# Altium schematic sheet HPC_EF.SchDoc: HPC connector ROW E and ROW F
size A4; Date: 20.05.2022; ApprovedBy: PFH; CompanyName: IAM Electronic GmbH; DrawnBy: PFH; Engineer: PFH; Revision: A; SheetNumber: 4; SheetTotal: 6; Projekt: FMC Power Module; Website: www.iamelectronic.com
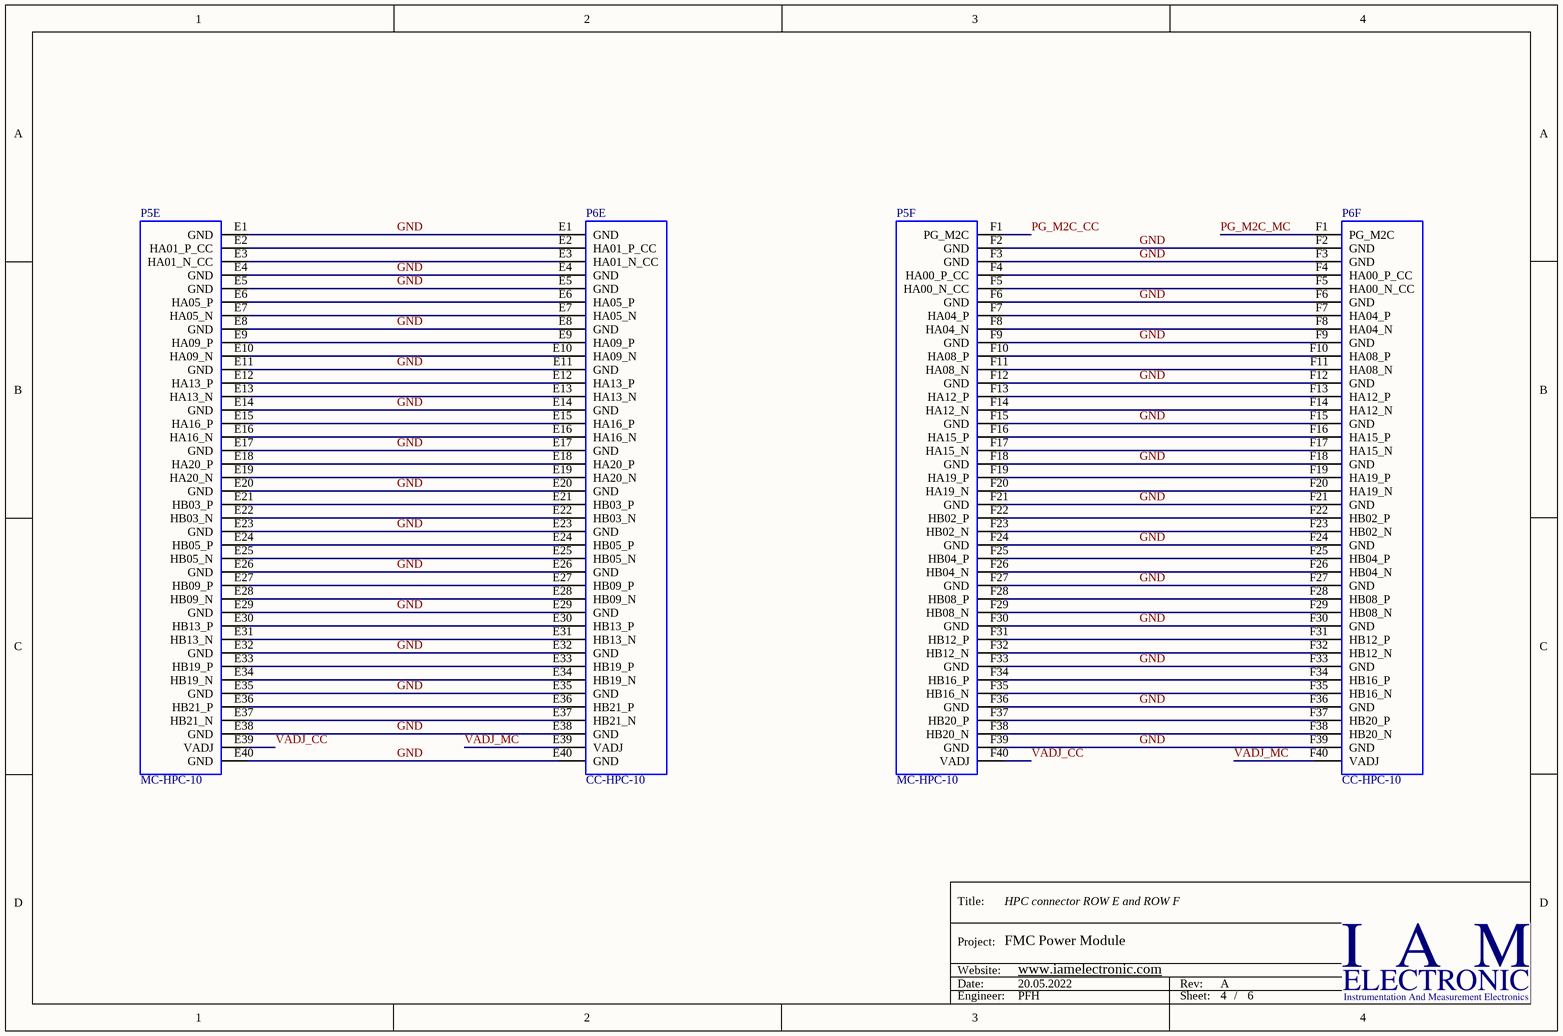
[diagram p0: HPC_EF.SchDoc]

## Parts
P5  MC-HPC-10  [ASP-134488-01]  (parts E,F of 10)
P6  CC-HPC-10  [ASP-134486-01]  (parts E,F of 10)

## Nets
GND: P5.E1(GND) P5.E4(GND) P5.E5(GND) P5.E8(GND) P5.E11(GND) P5.E14(GND) P5.E17(GND) P5.E20(GND) P5.E23(GND) P5.E26(GND) P5.E29(GND) P5.E32(GND) P5.E35(GND) P5.E38(GND) P5.E40(GND) P5.F2(GND) P5.F3(GND) P5.F6(GND) P5.F9(GND) P5.F12(GND) P5.F15(GND) P5.F18(GND) P5.F21(GND) P5.F24(GND) P5.F27(GND) P5.F30(GND) P5.F33(GND) P5.F36(GND) P5.F39(GND) P6.E1(GND) P6.E4(GND) P6.E5(GND) P6.E8(GND) P6.E11(GND) P6.E14(GND) P6.E17(GND) P6.E20(GND) P6.E23(GND) P6.E26(GND) P6.E29(GND) P6.E32(GND) P6.E35(GND) P6.E38(GND) P6.E40(GND) P6.F2(GND) P6.F3(GND) P6.F6(GND) P6.F9(GND) P6.F12(GND) P6.F15(GND) P6.F18(GND) P6.F21(GND) P6.F24(GND) P6.F27(GND) P6.F30(GND) P6.F33(GND) P6.F36(GND) P6.F39(GND)
PG_M2C_CC: P5.F1(PG_M2C)
PG_M2C_MC: P6.F1(PG_M2C)
VADJ_CC: P5.E39(VADJ) P5.F40(VADJ)
VADJ_MC: P6.E39(VADJ) P6.F40(VADJ)
NetP5_E2: P5.E2(HA01_P_CC) P6.E2(HA01_P_CC)
NetP5_E3: P5.E3(HA01_N_CC) P6.E3(HA01_N_CC)
NetP5_E6: P5.E6(HA05_P) P6.E6(HA05_P)
NetP5_E7: P5.E7(HA05_N) P6.E7(HA05_N)
NetP5_E9: P5.E9(HA09_P) P6.E9(HA09_P)
NetP5_E10: P5.E10(HA09_N) P6.E10(HA09_N)
NetP5_E12: P5.E12(HA13_P) P6.E12(HA13_P)
NetP5_E13: P5.E13(HA13_N) P6.E13(HA13_N)
NetP5_E15: P5.E15(HA16_P) P6.E15(HA16_P)
NetP5_E16: P5.E16(HA16_N) P6.E16(HA16_N)
NetP5_E18: P5.E18(HA20_P) P6.E18(HA20_P)
NetP5_E19: P5.E19(HA20_N) P6.E19(HA20_N)
NetP5_E21: P5.E21(HB03_P) P6.E21(HB03_P)
NetP5_E22: P5.E22(HB03_N) P6.E22(HB03_N)
NetP5_E24: P5.E24(HB05_P) P6.E24(HB05_P)
NetP5_E25: P5.E25(HB05_N) P6.E25(HB05_N)
NetP5_E27: P5.E27(HB09_P) P6.E27(HB09_P)
NetP5_E28: P5.E28(HB09_N) P6.E28(HB09_N)
NetP5_E30: P5.E30(HB13_P) P6.E30(HB13_P)
NetP5_E31: P5.E31(HB13_N) P6.E31(HB13_N)
NetP5_E33: P5.E33(HB19_P) P6.E33(HB19_P)
NetP5_E34: P5.E34(HB19_N) P6.E34(HB19_N)
NetP5_E36: P5.E36(HB21_P) P6.E36(HB21_P)
NetP5_E37: P5.E37(HB21_N) P6.E37(HB21_N)
NetP5_F4: P5.F4(HA00_P_CC) P6.F4(HA00_P_CC)
NetP5_F5: P5.F5(HA00_N_CC) P6.F5(HA00_N_CC)
NetP5_F7: P5.F7(HA04_P) P6.F7(HA04_P)
NetP5_F8: P5.F8(HA04_N) P6.F8(HA04_N)
NetP5_F10: P5.F10(HA08_P) P6.F10(HA08_P)
NetP5_F11: P5.F11(HA08_N) P6.F11(HA08_N)
NetP5_F13: P5.F13(HA12_P) P6.F13(HA12_P)
NetP5_F14: P5.F14(HA12_N) P6.F14(HA12_N)
NetP5_F16: P5.F16(HA15_P) P6.F16(HA15_P)
NetP5_F17: P5.F17(HA15_N) P6.F17(HA15_N)
NetP5_F19: P5.F19(HA19_P) P6.F19(HA19_P)
NetP5_F20: P5.F20(HA19_N) P6.F20(HA19_N)
NetP5_F22: P5.F22(HB02_P) P6.F22(HB02_P)
NetP5_F23: P5.F23(HB02_N) P6.F23(HB02_N)
NetP5_F25: P5.F25(HB04_P) P6.F25(HB04_P)
NetP5_F26: P5.F26(HB04_N) P6.F26(HB04_N)
NetP5_F28: P5.F28(HB08_P) P6.F28(HB08_P)
NetP5_F29: P5.F29(HB08_N) P6.F29(HB08_N)
NetP5_F31: P5.F31(HB12_P) P6.F31(HB12_P)
NetP5_F32: P5.F32(HB12_N) P6.F32(HB12_N)
NetP5_F34: P5.F34(HB16_P) P6.F34(HB16_P)
NetP5_F35: P5.F35(HB16_N) P6.F35(HB16_N)
NetP5_F37: P5.F37(HB20_P) P6.F37(HB20_P)
NetP5_F38: P5.F38(HB20_N) P6.F38(HB20_N)

## Notes on the sheet
- Title:
- Project:
- Date:
- Website:
- Rev:
- Engineer:
- Sheet:
- /

## Library data of the parts
P5 = MC-HPC-10: MC-HPC-10, FMC High-pin count connector, lead free, 400 I/Os, male, 10 mm mated stack height; Manufacturer: Samtec; Manufacturer Ref: SEAM-40-03.5-S-10-2-A-K-TR-VITA57.0; Pitch: 1.27 mm; Mated Stack Height: 10 mm; Solder Type: Lead-Free; Number I/O: 400; PartName: ASP-134488-01; Part: ASP-134488-01; Vita PartNumber: MC-HPC-10; Pin Count: High; Gender: male; Supplier 1: Digi-Key; Supplier Part Number 1: SAM8730-ND
P6 = CC-HPC-10: CC-HPC-10, FMC High-pin count connector, lead free, 400 I/Os, female, 10 mm mated stack height; Manufacturer: Samtec; Manufacturer Ref: SEAF-40-06.5-10-A; Pitch: 1.27 mm; Mated Stack Height: 10 mm; Solder Type: Lead-Free; Number I/O: 400; PartName: ASP-134486-01; Part: ASP-134486-01; Vita PartNumber: CC-HPC-10; Pin Count: High; Gender: female; Supplier 1: Digi-Key; Supplier Part Number 1: SAM8728-ND